# Altium project Battle_BOT.PrjPcb
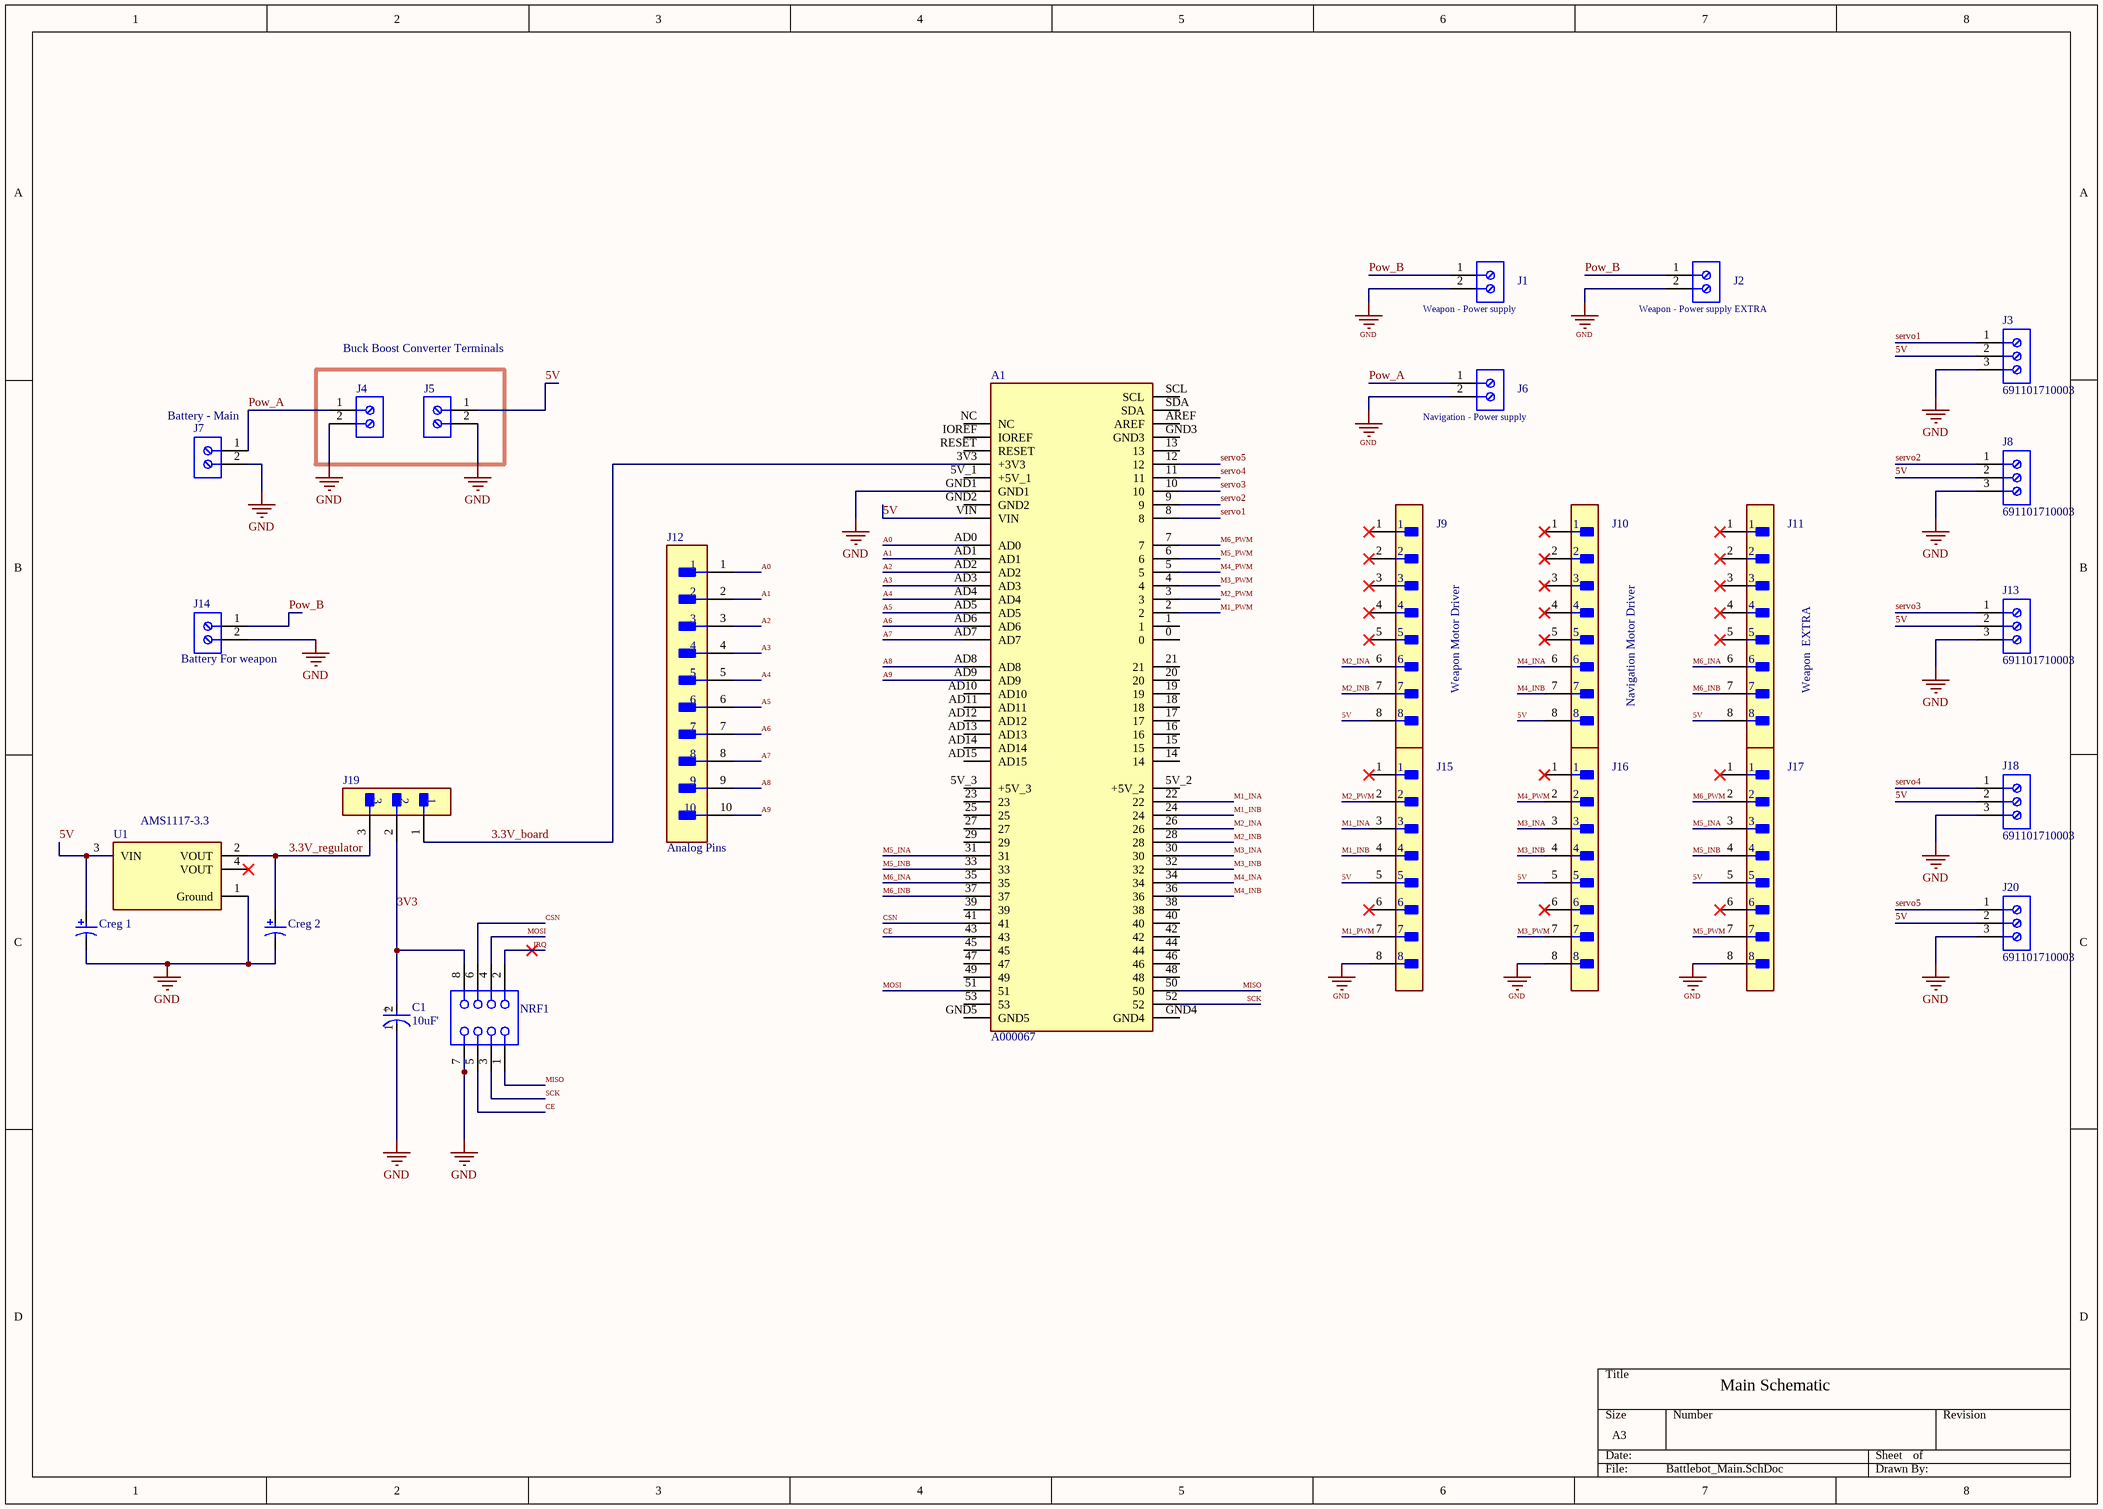
[diagram p0: Battlebot_Main.SchDoc]
1 sheet, 26 parts. Net scope: global (net labels, ports and power ports of the same name join across sheets).
Board file: Battlebot_Main_PCB.PcbDoc

## Sheet Battlebot_Main.SchDoc
size A3; SheetNumber: 1; SheetTotal: 1

### Parts
A1  A000067  [ARDUINO_A000067]
C1  10uF'  [FP-RAD-TH-D_5_0_5-L_11_1-MFG]
Creg_1  ECA1HM100  [CAPPR55-200-1100X500X1200]  (value not drawn)
Creg_2  ECA1HM100  [CAPPR55-200-1100X500X1200]  (value not drawn)
J1  Weapon - Power supply  [691213710002]
J2  Weapon - Power supply EXTRA  [691213710002]
J3  691101710003  [691101710003]
J4  691213710002  [691213710002]  (value not drawn)
J5  691213710002  [691213710002]  (value not drawn)
J6  Navigation - Power supply  [691213710002]
J7  691213710002  [691213710002]  (value not drawn)
J8  691101710003  [691101710003]
J9  PREC008SAAN-RC  [FP-PREC008SAAN-RC-MFG]  (value not drawn)
J10  PREC008SAAN-RC  [FP-PREC008SAAN-RC-MFG]  (value not drawn)
J11  PREC008SAAN-RC  [FP-PREC008SAAN-RC-MFG]  (value not drawn)
J12  Analog Pins  [FP-4-644456-0-MFG]
J13  691101710003  [691101710003]
J14  691213710002  [691213710002]  (value not drawn)
J15  PREC008SAAN-RC  [FP-PREC008SAAN-RC-MFG]  (value not drawn)
J16  PREC008SAAN-RC  [FP-PREC008SAAN-RC-MFG]  (value not drawn)
J17  PREC008SAAN-RC  [FP-PREC008SAAN-RC-MFG]  (value not drawn)
J18  691101710003  [691101710003]
J19  22-28-4030  [FP-22-28-4030-MFG]  (value not drawn)
J20  691101710003  [691101710003]
NRF1  SSW-104-02-G-D  [SMTC-SSW-104-02-X-D]  (value not drawn)
U1  AMS1117-3.3  [FP-AMS1117-IPC_C]

### Blocks framed on the sheet
Buck Boost Converter Terminals: J4 J5

### Nets
GND: A1.GND1 C1.1(C) Creg_1.2 Creg_2.2 J1.2 J2.2 J3.3 J4.2 J5.2 J6.2 J7.2 J8.3 J13.3 J14.2 J15.8 J16.8 J17.8 J18.3 J20.3 NRF1.7 U1.1(Ground)
3.3V_board: A1.3V3(+3V3) J19.1
3.3V_regulator: Creg_2.1 J19.3 U1.2(VOUT)
3V3: C1.2(A) J19.2 NRF1.8
5V: A1.VIN Creg_1.1 J3.2 J5.1 J8.2 J9.8 J10.8 J11.8 J13.2 J15.5 J16.5 J17.5 J18.2 J20.2 U1.3(VIN)
A0: A1.AD0 J12.1
A1: A1.AD1 J12.2
A2: A1.AD2 J12.3
A3: A1.AD3 J12.4
A4: A1.AD4 J12.5
A5: A1.AD5 J12.6
A6: A1.AD6 J12.7
A7: A1.AD7 J12.8
A8: A1.AD8 J12.9
A9: A1.AD9 J12.10
CE: A1.43 NRF1.5
CSN: A1.41 NRF1.6
IRQ: NRF1.2
M1_INA: A1.22 J15.3
M1_INB: A1.24 J15.4
M1_PWM: A1.2 J15.7
M2_INA: A1.26 J9.6
M2_INB: A1.28 J9.7
M2_PWM: A1.3 J15.2
M3_INA: A1.30 J16.3
M3_INB: A1.32 J16.4
M3_PWM: A1.4 J16.7
M4_INA: A1.34 J10.6
M4_INB: A1.36 J10.7
M4_PWM: A1.5 J16.2
M5_INA: A1.31 J17.3
M5_INB: A1.33 J17.4
M5_PWM: A1.6 J17.7
M6_INA: A1.35 J11.6
M6_INB: A1.37 J11.7
M6_PWM: A1.7 J17.2
MISO: A1.50 NRF1.1
MOSI: A1.51 NRF1.4
Pow_A: J4.1 J6.1 J7.1
Pow_B: J1.1 J2.1 J14.1
SCK: A1.52 NRF1.3
servo1: A1.8 J3.1
servo2: A1.9 J8.1
servo3: A1.10 J13.1
servo4: A1.11 J18.1
servo5: A1.12 J20.1

Not connected (* = marked no-connect by the designer): A1 0 1 5V_1(+5V_1) 5V_2(+5V_2) 5V_3(+5V_3) 13 14 15 16 17 18 19 20 21 23 25 27 29 38 39 40 42 44 45 46 47 48 49 53 AD10 AD11 AD12 AD13 AD14 AD15 AREF GND2 GND3 GND4 GND5 IOREF NC RESET SCL SDA; J9 1* 2* 3* 4* 5*; J10 1* 2* 3* 4* 5*; J11 1* 2* 3* 4* 5*; J15 1* 6*; J16 1* 6*; J17 1* 6*; U1 4(VOUT)*

### Notes on the sheet
- (near J7) Battery - Main
- (near J14) Battery For weapon
- Weapon Motor Driver
- Navigation Motor Driver
- Weapon  EXTRA
- Main Schematic
- (in symbol CMP-05427-000413-1) +

### Library data of the parts
A1 = A000067: arduino mega 2560 rev3. ATmega2560 Mikrodenetleyici Mega GeliÅŸtirme KartÄ± 16MHz CPU 8KB RAM 4KB/256KB EEPROM/Flash; Price: None; Availability: In Stock; MP: A000067; Package: Non-Standard Arduino; SnapEDA_Link: https://www.snapeda.com/parts/A000067/Arduino/view-part/?ref=snap; Check_prices: https://www.snapeda.com/parts/A000067/Arduino/view-part/?ref=eda; Value: *; Purchase-URL: https://pricing.snapeda.com/search/part/A000067/?ref=eda; MF: Arduino
C1 = CMP-05427-000413-1: Aluminum Electrolytic Capacitors (Radial Lead Type) AEC-Q200 Qualified 47uF ±20% 35V; Polarity: Polar; Ripple Current (AC): 90mA; Life (Hours): 1000Hour; Lead/Base Style: Straight; Lead Diameter: 0.5mm; Voltage: 35V; Case/Package: Radial; Package Quantity: 200; Number of Pins: 2; REACH SVHC: No SVHC; Height: 11mm; Mount: Through Hole; Series: HD; Construction: RADIAL; Voltage Rating (DC): 35V; Diameter: 5mm; Voltage Rating: 35V; Ripple Current: 90mA; Height - Seated (Max): 0.492inch; Lead Free: Lead Free; Length: 11mm; Tolerance: 20%; RoHS Compliant: Yes; Packaging: Bulk; Capacitance: 47uF; Min Operating Temperature: -55°C; Termination: Radial; Lead Pitch: 2.5mm; Max Operating Temperature: 105°C
Creg_1 Creg_2 = CMP-1665-00038-2: Aluminum Electrolytic Capacitor, 10 uF, +/- 20%, 50 V, -40 to 85 degC, 2-Pin THD, RoHS, Bulk; Manufacturer: Panasonic; Life (Hours): 2000Hour; Lead/Base Style: Straight; Dissipation Factor: 0.12%; Capacitance: 10uF; Leakage Current: 3uA; Dielectric Material: Aluminium; Lead Diameter: 0.5mm; Voltage Rating: 50V; Ripple Current: 65mA; Package Reference: CAPPR55-200-1100X500X1200; Height: 11mm; Diameter: 5mm; REACH SVHC: NoSVHC; Mount: ThroughHole; Packaging: Bulk; Manufacturer URL: http://www.panasonic.com/; Termination: Radial; Datasheet URL: https://industrial.panasonic.com/cdbs/www-data/pdf/RDF0000/ABA0000C1218.pdf; Lead Free: LeadFree; Height - Seated (Max): 0.472inch; Case/Package: Radial; Package Description: 2-Pin Radial Lead, Dia 5 mm, Height 12 mm; Tolerance: 20%; Datasheet Version: Rev. 05, 10/2016; Package Quantity: 200; Ripple Current (AC): 65mA; Min Operating Temperature: -40degC; RoHSCompliant: true; Number of Pins: 2; Max Operating Temperature: 85degC; Voltage: 50V; Lead Pitch: 2mm; Radiation Hardening: No; Voltage Rating (DC): 50V; Length: 11mm
J1 J2 J4-J7 J14 = CMP-1502-02526-1: Serie 213 - 5.00 mm Horizontal Entry Modular with RisingCage Clamp WR-TBL, 2 pin; Manufacturer: Wurth Elektronik; Pin Number: 2; Pitch: 5.00mm; Packaging: Box; Datasheet URL: http://katalog.we-online.de/em/datasheet/6912137100xx.pdf; Mounting Technology: THT; Part Number: 691213710002; Operating Temperature: -40to105degC; Publisher: WurthElektronik; Manufacturer URL: http://www.we-online.de; Package Reference: 691213710002
J3 J8 J13 J18 J20 = CMP-1502-03257-2: NexarPartId: 8917705; Voltage Rating: 250V; Current: 16A; Wire Gauge (Min): 14AWG; Pitch: 5.0038mm; Wire Gauge (Max): 26AWG; Number of Positions Per Level: 3; Plating: Steel; Number of Levels: 1; Stripping Length: -7mm; REACH SVHC: Unknown; Width: 16.2mm; Height: 16.4mm; Contact Material: Brass; RoHS: Compliant; Color: Blue; Contact Plating: Tin; Lead Pitch: 5mm; Packaging: Box; Termination: Screw; Number of Contacts: 3; Wire/Cable Gauge: 26AWG; Min Operating Temperature: -40°C; Max Operating Temperature: 105°C; Housing Material: Nylon; Length: 9mm; Voltage: 250V; Mount: Through Hole; Current Rating: 16A; Number of Pins: 3
J9-J11 J15-J17 = CMP-25680-000013-1: CONN HEADER VERT 8POS 2.54MM; Manufacturer: Sullins; Conn Orientation: Straight; Conn Gender: Male; Current Rating: 3A; Number Of Contacts: 8; Device Class L2: Headers and Wire Housings; Temperature Range High: +105°C; Contact Material: Tin,Nickel; Automotive: No; Pitch: 2.54mm; ComponentLink2Description: Datasheet; Height: 8.74mm; Device Class L3: unset; RoHS: TRUE; Manufacturer Part Number: PREC008SAAN-RC; Package: PREC008SAAN-RC; Lead Free: Yes; Device Class L1: Connectors; Number Of Rows: 1; Digikey Description: CONN HEADER VERT 8POS 2.54MM; Category: Conn; ComponentLink2URL: https://drawings-pdf.s3.amazonaws.com/11635.pdf; Octopart: https://octopart.com/prec008saan-rc-sullins-22265145; Temperature: -40°C to +105°C; Temperature Range Low: -40°C
J12 = CMP-03369-000038-1: CONN HEADER VERT 10POS 2.54MM; Manufacturer Part Number: 4-644456-0; Manufacturer: TE Connectivity; Current Rating: 5A; Conn Gender: Male; Number Of Contacts: 10; Conn Orientation: Vertical; Voltage Rating: 250V; Number Of Rows: 1; Device Class L3: unset; Octopart: https://octopart.com/4-644456-0-te+connectivity-39514173; Pitch: 2.54mm; Mouser Description: Headers & Wire Housings NARROW FLT HDR 10P Straight Post; ComponentLink2Description: Datasheet; Height: 0.408inch; Package: 4-644456-0; RoHS: TRUE; Temperature Range High: +105°C; Digikey Description: CONN HEADER VERT 10POS 2.54MM; Temperature: -55°C to +105°C; Device Class L2: Headers and Wire Housings; Automotive: No; Lead Free: Yes; Contact Material: Tin; Temperature Range Low: -55°C; Footprint Url: https://www.te.com/commerce/DocumentDelivery/DDEController?Action=showdoc&DocId=Customer+Drawing%7F644456%7FD2%7Fpdf%7FEnglish%7FENG_CD_644456_D2.pdf%7F4-644456-0; Device Class L1: Connectors; Category: Conn; ComponentLink2URL: https://www.te.com/commerce/DocumentDelivery/DDEController?Action=showdoc&DocId=Data+Sheet%7F82056_MTA%7F0818%7Fpdf%7FEnglish%7FENG_DS_82056_MTA_0818.pdf%7F4-644456-0
J19 = CMP-04776-000098-1: CONN HEADER VERT 3POS 2.54MM; Manufacturer: Molex; Conn Orientation: Vertical; Conn Gender: Male; Current Rating: 4A; Voltage Rating: 500V; Number Of Contacts: 3; Category: Conn; Number Of Rows: 1; Manufacturer Part Number: 22-28-4030; RoHS: TRUE; Package: 22-28-4030; Footprint Url: https://www.molex.com/pdm_docs/sd/022284030_sd.pdf; ComponentLink2Description: Datasheet; Device Class L2: Headers and Wire Housings; Automotive: No; Temperature Range Low: -40°C; Digikey Description: CONN HEADER VERT 3POS 2.54MM; Mouser Description: Headers & Wire Housings 3P VERT HEADER Sn; Contact Material: Gold,Nickel; Pitch: 2.54mm; Device Class L1: Connectors; Lead Free: Yes; Device Class L3: unset; Temperature Range High: +80°C; Octopart: https://octopart.com/0022284030-molex-10476094; ComponentLink2URL: https://www.molex.com/webdocs/datasheets/pdf/en-us/0022284030_PCB_HEADERS.pdf; Height: 8.88mm; Temperature: -40°C to +80°C
NRF1 = CMP-1023-00343-1: SQ Post Socket, Through-hole, Vertical, -55 to 125 degC, 2.54mm Pitch, 8-Pin, Female, RoHS; Manufacturer: Samtec; Mounting Technology: Through-hole; ComponentLink1Description: Manufacturer URL; Orientation: Vertical; Pitch: 2.54 mm; PartNumber: SSW-104-02-G-D; ComponentLink2URL: http://www.samtec.com/documents/webfiles/pdf/SSW_TH.PDF; PackageReference: SSW-104-02-X-D; ComponentLink3Description: Package Specification; PackageVersion: CA, 6/1987; PackageDescription: Assembly, Socket Strip .016 X .031 Tail; ComponentLink2Description: Datasheet; RoHS: True; ComponentLink1URL: http://www.samtec.com; ComponentLink3URL: http://www.samtec.com/documents/webfiles/cpdf/SSW-1XX-XX-XXX-X-XX-XXX-XX-MKT.pdf; DatasheetVersion: F-214; Temperature Range: -55 to 125 degC
U1 = CMP-209535-000001-1: LDO Voltage Regulators 1A, 3.3V; Manufacturer: Advanced Monolithic Systems; Dropout Voltage: 1.1V; Output Type: Fixed; Nominal Supply Current: 5mA; Max Power Dissipation: 1.2W; Max Supply Voltage: 15V; Number Of Outputs: 1; Standoff Height: 0.64mm; Max Junction Temp: +125°C; Height: 1.8mm; Package: AMS1117; Device Class L2: Power Management ICs; ComponentLink2Description: Datasheet; ComponentLink2URL: http://www.advanced-monolithic.com/pdf/ds1117.pdf; Category: IC; RoHS: TRUE; Automotive: No; Device Class L1: Integrated Circuits (ICs); Output Current: 1A; Device Class L3: Voltage Regulators - Linear; Temperature: -40°C to +125°C; Output Voltage: 3.3V; Manufacturer Part Number: AMS1117-3.3; Temperature Range Low: -40°C; Octopart: https://octopart.com/ams1117-3.3-advanced+monolithic+systems-25899300; Lead Free: Yes; Ipc Land Pattern Name: SOT229P700X180-4; Temperature Range High: +125°C